# Altium schematic sheet floppy_m0dule.SchDoc: Floppy Orgel v3.0 - Floppy M0dule
size A4; Author: coon@c-base.org; SheetNumber: 1; SheetTotal: 1; PageSetup: Record=PageOptions|CenterHorizontal=True|CenterVertical=True|PrintScale=1.00|XCorrection=1.00|YCorrection=1.00|PrintKind=0|BorderSize=5000000|LeftOffset=0|BottomOffset=0|Orientation=2|PaperLength=1000|PaperWidth=1000|Scale=100|PaperSource=7|PrintQuality=-4|MediaType=1|DitherType=10|PaperKind=A4|PrintScaleMode=1
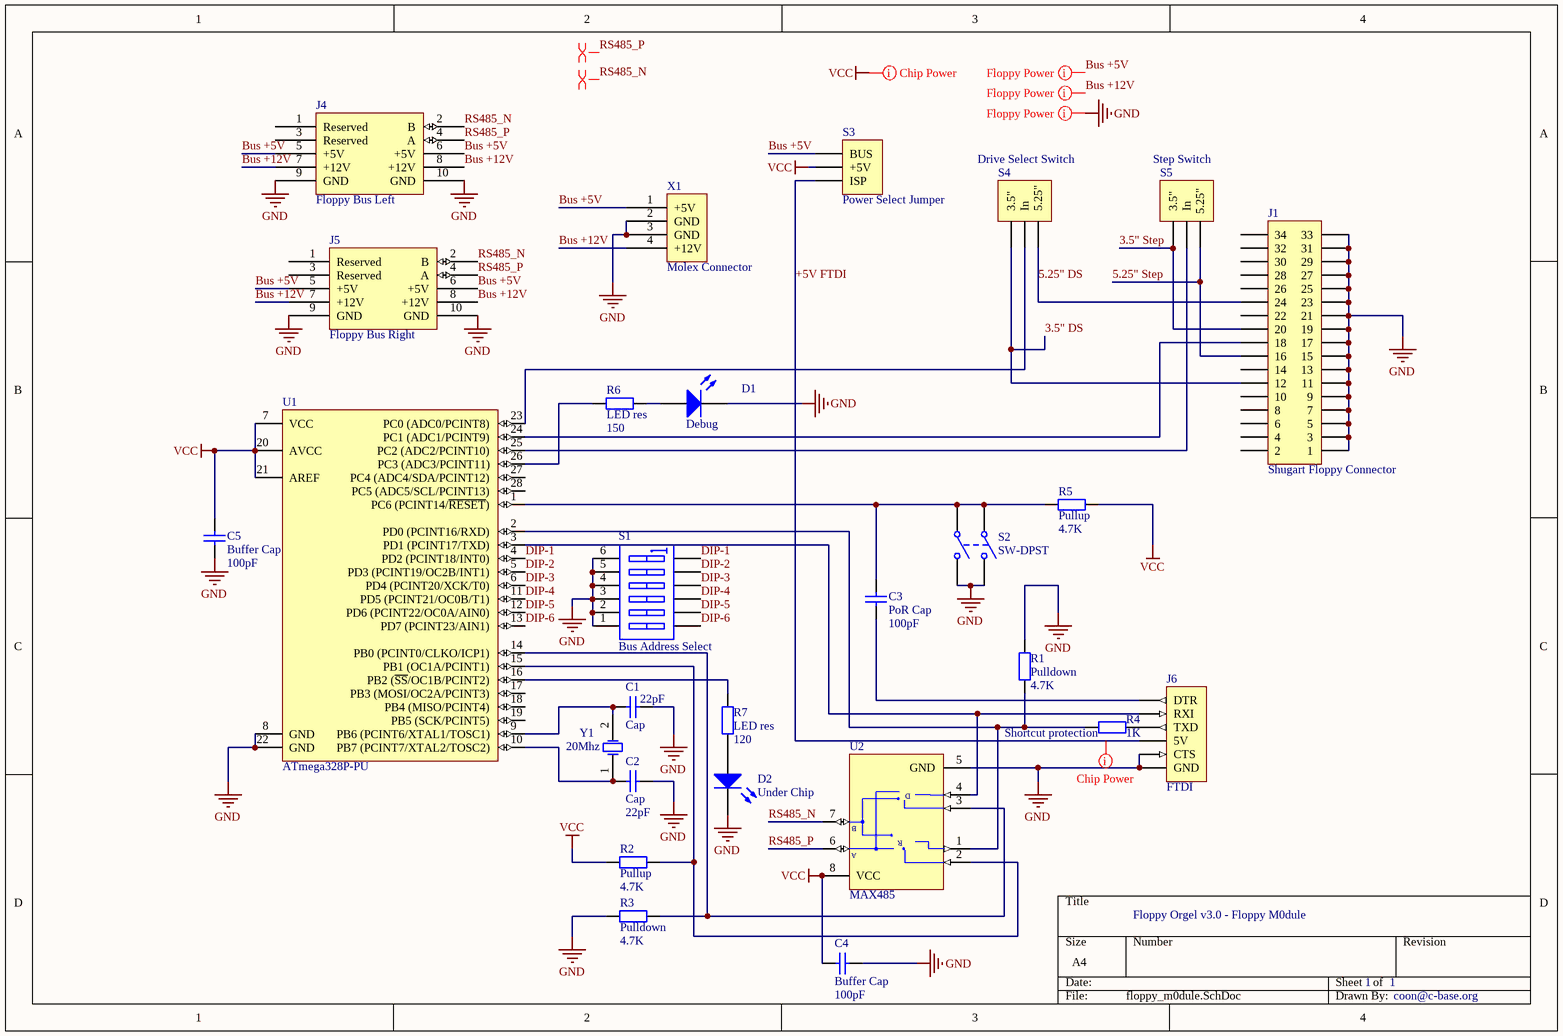
[diagram p0: floppy_m0dule.SchDoc]

## Parts
C1  Cap  value 22pF  [RAD-0.1]
C2  Cap  value 22pF  [RAD-0.1]
C3  PoR Cap  value 100pF  [RAD-0.1]
C4  Buffer Cap  value 100pF  [C1206]
C5  Buffer Cap  value 100pF  [C1206]
D1  Debug  [0805 LED]
D2  Under Chip  [0805 LED]
J1  Shugart Floppy Connector  [HDR2X17]
J4  Floppy Bus Left  [Shrouded Pinheader 2x5]
J5  Floppy Bus Right  [Shrouded Pinheader 2x5]
J6  FTDI  [HDR1X6]
R1  Pulldown  value 4.7K  [AXIAL-0.4]
R2  Pullup  value 4.7K  [AXIAL-0.4]
R3  Pulldown  value 4.7K  [AXIAL-0.4]
R4  Shortcut protection  value 1K  [AXIAL-0.4]
R5  Pullup  value 4.7K  [AXIAL-0.4]
R6  LED res  value 150  [R0805]
R7  LED res  value 120  [R0805]
S1  Bus Address Select  [418117170906]
S2  SW-DPST  [SWITCH]
S3  Power Select Jumper  [HDR1X3]
S4  Drive Select Switch  [0805 SMD Switch Pads]
S5  Step Switch  [0805 SMD Switch Pads]
U1  ATmega328P-PU  [28P3]
U2  MAX485  [PA8]
X1  Molex Connector  [HDR1X4]
Y1  20Mhz  [crystal]

## Nets
GND: C1.2 C2.2 C4.1 C5.1 D1.2(K) D2.2(K) J1.1 J1.3 J1.5 J1.7 J1.9 J1.11 J1.13 J1.15 J1.17 J1.19 J1.21 J1.23 J1.25 J1.27 J1.29 J1.31 J1.33 J4.9(GND) J4.10(GND) J5.9(GND) J5.10(GND) J6.5(CTS) J6.6(GND) R1.2 R3.1 S1.1(A1) S1.2(A2) S1.3(A3) S1.4(A4) S1.5(A5) S1.6(A6) S2.2(NO1) S2.4(NO2) U1.8(GND) U1.22(GND) U2.5(GND) X1.2(GND) X1.3(GND)
VCC: C4.2 C5.2 R2.1 R5.2 S3.2(+5V) U1.7(VCC) U1.20(AVCC) U1.21(AREF) U2.8(VCC)
3.5" DS: J1.12 S4.1(3.5")
3.5" Step: J1.20 S5.1(3.5")
5.25" DS: J1.24 S4.3(5.25")
5.25" Step: J1.16 S5.3(5.25")
+5V FTDI: J6.4(5V) S3.3(ISP)
Bus +5V: J4.5(+5V) J4.6(+5V) J5.5(+5V) J5.6(+5V) S3.1(BUS) X1.1(+5V)
Bus +12V: J4.7(+12V) J4.8(+12V) J5.7(+12V) J5.8(+12V) X1.4(+12V)
DIP-1: S1.12(B1) U1.4(PD2_(PCINT18/INT0))
DIP-2: S1.11(B2) U1.5(PD3_(PCINT19/OC2B/INT1))
DIP-3: S1.10(B3) U1.6(PD4_(PCINT20/XCK/T0))
DIP-4: S1.9(B4) U1.11(PD5_(PCINT21/OC0B/T1))
DIP-5: S1.8(B5) U1.12(PD6_(PCINT22/OC0A/AIN0))
DIP-6: S1.7(B6) U1.13(PD7_(PCINT23/AIN1))
RS485_N: J4.2(B) J5.2(B) U2.7(B)
RS485_P: J4.4(A) J5.4(A) U2.6(A)
NetC1_1: C1.1 U1.9(PB6_(PCINT6/XTAL1/TOSC1)) Y1.2(OSC2)
NetC2_1: C2.1 U1.10(PB7_(PCINT7/XTAL2/TOSC2)) Y1.1(OSC1)
NetC3_1: C3.1 J6.1(DTR)
NetC3_2: C3.2 R5.1 S2.1(COMMON1) S2.3(COMMON2) U1.1(PC6_(PCINT14/~{RESET}))
NetD1_1: D1.1(A) R6.2
NetD2_1: D2.1(A) R7.1
NetJ1_18: J1.18 U1.24(PC1_(ADC1/PCINT9))
NetJ6_2: J6.2(RXI) U1.3(PD1_(PCINT17/TXD)) U2.4(DI)
NetJ6_3: J6.3(TXD) R4.2
NetR1_1: R1.1 R4.1 U1.2(PD0_(PCINT16/RXD)) U2.1(RO)
NetR2_2: R2.2 U1.15(PB1_(OC1A/PCINT1)) U2.2(~{RE})
NetR3_2: R3.2 U1.14(PB0_(PCINT0/CLKO/ICP1)) U2.3(DE)
NetR6_1: R6.1 U1.26(PC3_(ADC3/PCINT11))
NetR7_2: R7.2 U1.16(PB2_(~{SS}/OC1B/PCINT2))
NetS4_2: S4.2(In) U1.23(PC0_(ADC0/PCINT8))
NetS5_2: S5.2(In) U1.25(PC2_(ADC2/PCINT10))

Not connected (* = marked no-connect by the designer): J1 2 4 6 8 10 14 22 26 28 30 32 34; J4 1(Reserved) 3(Reserved); J5 1(Reserved) 3(Reserved); U1 17(PB3_(MOSI/OC2A/PCINT3)) 18(PB4_(MISO/PCINT4)) 19(PB5_(SCK/PCINT5)) 27(PC4_(ADC4/SDA/PCINT12)) 28(PC5_(ADC5/SCL/PCINT13))

## Layout directives
net class Floppy Power: (no net found under the mark), GND
net class Chip Power: +5V FTDI, VCC
differential pair: (no net found under the mark)

## Notes on the sheet
- Labels drawn without touching a wire or pin: Bus +5V, Bus +12V, GND, RS485_N, RS485_P, VCC
- (in symbol MAX485EPA) D; R

## Library data of the parts
C1-C3 = Cap: Capacitor; Published: 8-Jun-2000; LatestRevisionDate: 17-Jul-2002; LatestRevisionNote: Re-released for DXP Platform.; PackageReference: RAD-0.3; Publisher: Altium Limited; PackageDescription: Radial Cap, Thru-Hole; 2 Leads; 0.3 in Pin Spacing
C4 C5 = Cap Semi: Capacitor (Semiconductor SIM Model); Published: 8-Jun-2000; LatestRevisionDate: 29-May-2009; LatestRevisionNote: IPC-7351 Footprint Added.; PackageReference: C1206; Publisher: Altium Limited; PackageDescription: Chip Capacitor
D1 D2 = LED3: Typical BLUE SiC LED; Published: 8-Jun-2000; LatestRevisionDate: 17-Dec-2003; LatestRevisionNote: PCB Footprint replaced.; DatasheetVersion: 16-Apr-2002; PackageVersion: 16-Apr-2002; PackageReference: 3.5X2.8X1.9; Publisher: Altium Limited; PackageDescription: SM LED; 2 C-Bend Leads; Body 3.5 x 2.8 x 1.9 mm, inc leads (LxWxH typ)
J1 = Header 17X2: Header, 17-Pin, Dual row; LatestRevisionDate: 17-Jul-2002; LatestRevisionNote: Re-released for DXP Platform.; Publisher: Altium Limited
J4 J5 = Floppy Bus Connector: 10 Pin Floppy bus connector for rainbow cable; Published: 8-Jun-2000; LatestRevisionDate: 29-May-2009; LatestRevisionNote: IPC-7351 Footprint Added.; PackageVersion: Mar-2002; PackageReference: SOT403-1; Publisher: Altium Limited; PackageDescription: 16-Pin Thin Small Outline Package 0.65 mm Pitch; Code_JEDEC: MO-153
J6 = Header 6: Header, 6-Pin; LatestRevisionDate: 17-Jul-2002; LatestRevisionNote: Re-released for DXP Platform.; Publisher: Altium Limited
R1-R5 = Res2: Resistor; Published: 8-Jun-2000; LatestRevisionDate: 17-Jul-2002; LatestRevisionNote: Re-released for DXP Platform.; PackageReference: AXIAL-0.4; Publisher: Altium Limited; PackageDescription: Axial Device, Thru-Hole; 2 Leads; 0.4 in Pin Spacing
R6 = Res2: Resistor for Green LED 19.33mA @ 5V; Published: 8-Jun-2000; LatestRevisionDate: 17-Jul-2002; LatestRevisionNote: Re-released for DXP Platform.; PackageReference: AXIAL-0.4; Publisher: Altium Limited; PackageDescription: Axial Device, Thru-Hole; 2 Leads; 0.4 in Pin Spacing
R7 = Res2: Resistor for Blue LED 17.5mA @ 5V; Published: 8-Jun-2000; LatestRevisionDate: 17-Jul-2002; LatestRevisionNote: Re-released for DXP Platform.; PackageReference: AXIAL-0.4; Publisher: Altium Limited; PackageDescription: Axial Device, Thru-Hole; 2 Leads; 0.4 in Pin Spacing
S1 = SW DIP-6: Midi Channel Select; Published: 24-Mar-1999; LatestRevisionDate: 17-Jul-2002; LatestRevisionNote: Re-released for DXP Platform.; PackageReference: DIP-12/SW; Publisher: Altium Limited; PackageDescription: DIP Switch; 12 Leads
S2 = SW-DPST: Double-Pole, Single-Throw Switch; Published: 24-Mar-1999; LatestRevisionDate: 17-Jul-2002; LatestRevisionNote: Re-released for DXP Platform.; PackageReference: DPST-4; Publisher: Altium Limited; PackageDescription: Switch; 4 Leads
S3 = Header 3H: Header, 3-Pin, Right Angle; LatestRevisionDate: 17-Jul-2002; LatestRevisionNote: Re-released for DXP Platform.; Publisher: Altium Limited
S4 S5 = Header 3: Header, 3-Pin; LatestRevisionDate: 17-Jul-2002; LatestRevisionNote: Re-released for DXP Platform.; Publisher: Altium Limited
U1 = ATmega328P-PU: 8-bit AVR Microcontroller, 32KB Flash, 1KB EEPROM, 2KB SRAM, 28-pin PDIP, Industrial Grade (-40°C to 85°C); Published: 1-Apr-2010; DatasheetVersion: revA, Jan-2010; PackageVersion: revB, Sep-2001; PackageReference: 28P3; Publisher: Altium Limited; PackageDescription: 28-lead (0.300"/7.62mm Wide) Plastic Dual Inline Package (PDIP); Supplier 1: Digi-Key; Supplier Part Number 1: ATMEGA328P-PU-ND; Supplier 2: Farnell; Supplier Part Number 2: 1715487; Supplier 3: Mouser; Supplier Part Number 3: 556-ATMEGA328P-PU; ComponentLink1Description: Manufacturer Link; ComponentLink1URL: http://www.atmel.com/products/avr/default.asp?; ComponentLink2Description: ATmega48A/48PA/88A/88PA/168A/168PA/328/328P Datasheet; ComponentLink2URL: http://www.atmel.com/dyn/resources/prod_documents/8271.pdf; ComponentLink3Description: ATmega48A/48PA/88A/88PA/168A/168PA/328/328P Summary; ComponentLink3URL: http://www.atmel.com/dyn/resources/prod_documents/8271S.pdf; ComponentLink4Description: Atmel.com Home; ComponentLink4URL: http://www.atmel.com
U2 = MAX485EPA: Low-Power, Slew-Rate-Limited RS-485/RS-422 Transceiver; Published: 16-Jan-2001; LatestRevisionDate: 29-May-2009; LatestRevisionNote: Component Body Added.; DatasheetVersion: Feb-1996; PackageVersion: RevB, 21-0043; PackageReference: PA8; Publisher: Altium Limited; PackageDescription: DIP, 8-Pin, Row Spacing 7.62 mm, Pitch 2.54 mm; Code_JEDEC: MS-001-AB; ComponentLink1Description: Manufacturer Link; ComponentLink1URL: http://www.maxim-ic.com/; ComponentLink2Description: Datasheet; ComponentLink2URL: http://pdfserv.maxim-ic.com/en/ds/MAX1487-MAX491.pdf
X1 = Molex Connector: Molex Power Supply Connector; Published: 8-Jun-2000; LatestRevisionDate: 29-May-2009; LatestRevisionNote: IPC-7351 Footprint Added.; PackageVersion: Mar-2002; PackageReference: SOT403-1; Publisher: Altium Limited; PackageDescription: 16-Pin Thin Small Outline Package 0.65 mm Pitch; Code_JEDEC: MO-153
Y1 = XTAL: Crystal Oscillator; Published: 8-Jun-2000; LatestRevisionDate: 17-Jul-2002; LatestRevisionNote: Re-released for DXP Platform.; PackageReference: R38; Publisher: Altium Limited; PackageDescription: Crystal, Thru-Hole; 2 Leads; Body 3.1 x 8.2 mm (Dia.xH)